# EAGLE design main (EAGLE 9.6.2)
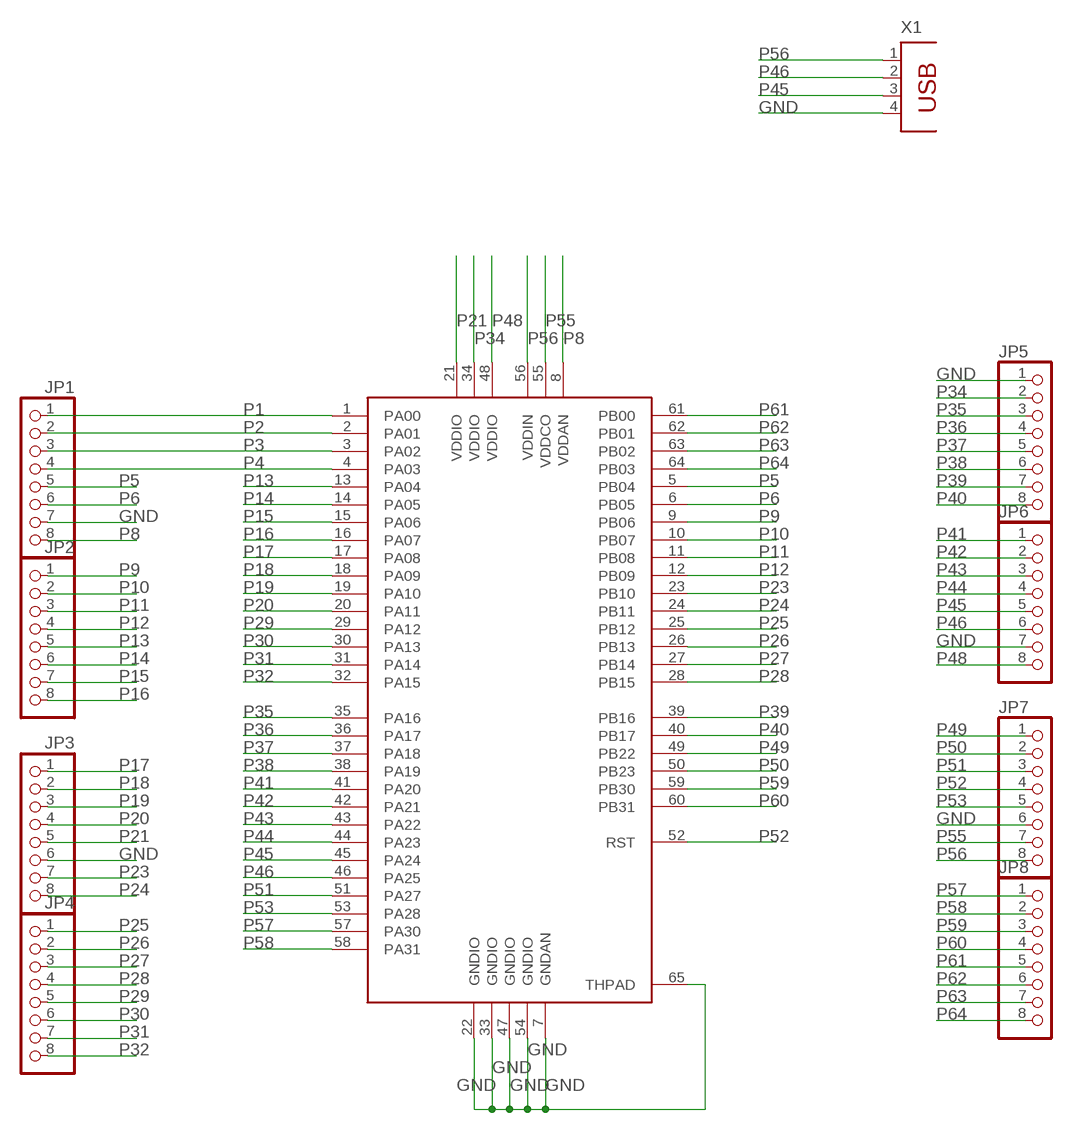
[diagram p0: schematic, sheet 1]

## Parts
JP1  PINHD-1X8CLEANBIG  [1X08-CLEANBIG]
JP2  PINHD-1X8CLEANBIG  [1X08-CLEANBIG]
JP3  PINHD-1X8CLEANBIG  [1X08-CLEANBIG]
JP4  PINHD-1X8CLEANBIG  [1X08-CLEANBIG]
JP5  PINHD-1X8CLEANBIG  [1X08-CLEANBIG]
JP6  PINHD-1X8CLEANBIG  [1X08-CLEANBIG]
JP7  PINHD-1X8CLEANBIG  [1X08-CLEANBIG]
JP8  PINHD-1X8CLEANBIG  [1X08-CLEANBIG]
U$1  ATSAMD21J18AQFN64  [QFN50P900X900X100-65T535]
X1  PN61729  [PN61729]

## Nets
GND: JP1.7 JP3.6 JP5.1 JP6.7 JP7.6 U$1.7(GNDAN) U$1.22(GNDIO) U$1.33(GNDIO) U$1.47(GNDIO) U$1.54(GNDIO) U$1.65(THPAD) X1.4
P1: JP1.1 U$1.1(PA00)
P2: JP1.2 U$1.2(PA01)
P3: JP1.3 U$1.3(PA02)
P4: JP1.4 U$1.4(PA03)
P5: JP1.5 U$1.5(PB04)
P6: JP1.6 U$1.6(PB05)
P8: JP1.8 U$1.8(VDDAN)
P9: JP2.1 U$1.9(PB06)
P10: JP2.2 U$1.10(PB07)
P11: JP2.3 U$1.11(PB08)
P12: JP2.4 U$1.12(PB09)
P13: JP2.5 U$1.13(PA04)
P14: JP2.6 U$1.14(PA05)
P15: JP2.7 U$1.15(PA06)
P16: JP2.8 U$1.16(PA07)
P17: JP3.1 U$1.17(PA08)
P18: JP3.2 U$1.18(PA09)
P19: JP3.3 U$1.19(PA10)
P20: JP3.4 U$1.20(PA11)
P21: JP3.5 U$1.21(VDDIO)
P23: JP3.7 U$1.23(PB10)
P24: JP3.8 U$1.24(PB11)
P25: JP4.1 U$1.25(PB12)
P26: JP4.2 U$1.26(PB13)
P27: JP4.3 U$1.27(PB14)
P28: JP4.4 U$1.28(PB15)
P29: JP4.5 U$1.29(PA12)
P30: JP4.6 U$1.30(PA13)
P31: JP4.7 U$1.31(PA14)
P32: JP4.8 U$1.32(PA15)
P34: JP5.2 U$1.34(VDDIO)
P35: JP5.3 U$1.35(PA16)
P36: JP5.4 U$1.36(PA17)
P37: JP5.5 U$1.37(PA18)
P38: JP5.6 U$1.38(PA19)
P39: JP5.7 U$1.39(PB16)
P40: JP5.8 U$1.40(PB17)
P41: JP6.1 U$1.41(PA20)
P42: JP6.2 U$1.42(PA21)
P43: JP6.3 U$1.43(PA22)
P44: JP6.4 U$1.44(PA23)
P45: JP6.5 U$1.45(PA24) X1.3
P46: JP6.6 U$1.46(PA25) X1.2
P48: JP6.8 U$1.48(VDDIO)
P49: JP7.1 U$1.49(PB22)
P50: JP7.2 U$1.50(PB23)
P51: JP7.3 U$1.51(PA27)
P52: JP7.4 U$1.52(RST)
P53: JP7.5 U$1.53(PA28)
P55: JP7.7 U$1.55(VDDCO)
P56: JP7.8 U$1.56(VDDIN) X1.1
P57: JP8.1 U$1.57(PA30)
P58: JP8.2 U$1.58(PA31)
P59: JP8.3 U$1.59(PB30)
P60: JP8.4 U$1.60(PB31)
P61: JP8.5 U$1.61(PB00)
P62: JP8.6 U$1.62(PB01)
P63: JP8.7 U$1.63(PB02)
P64: JP8.8 U$1.64(PB03)

## Library data of the parts
JP1-JP8 = larger_pad_header:PINHD-1X8: PIN HEADER
U$1 = atsamd21j18a:ATSAMD21J18A
X1 = con-berg:PN61729: BERG USB connector; OC_FARNELL: unknown; OC_NEWARK: unknown

## Board
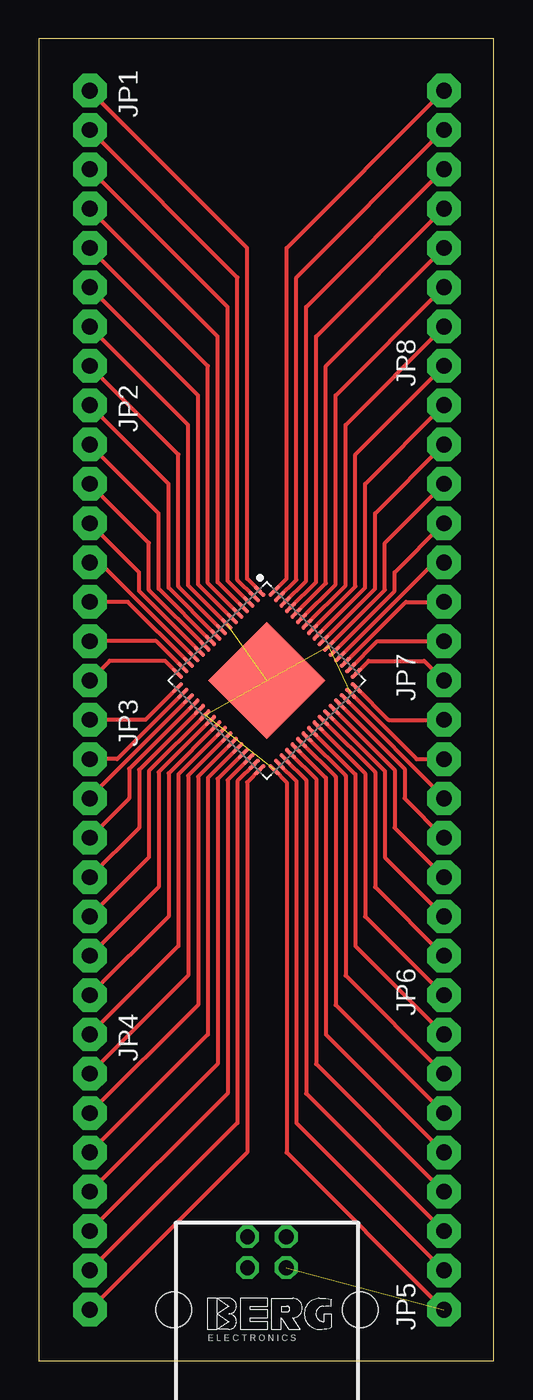
[diagram p1: board, top side]
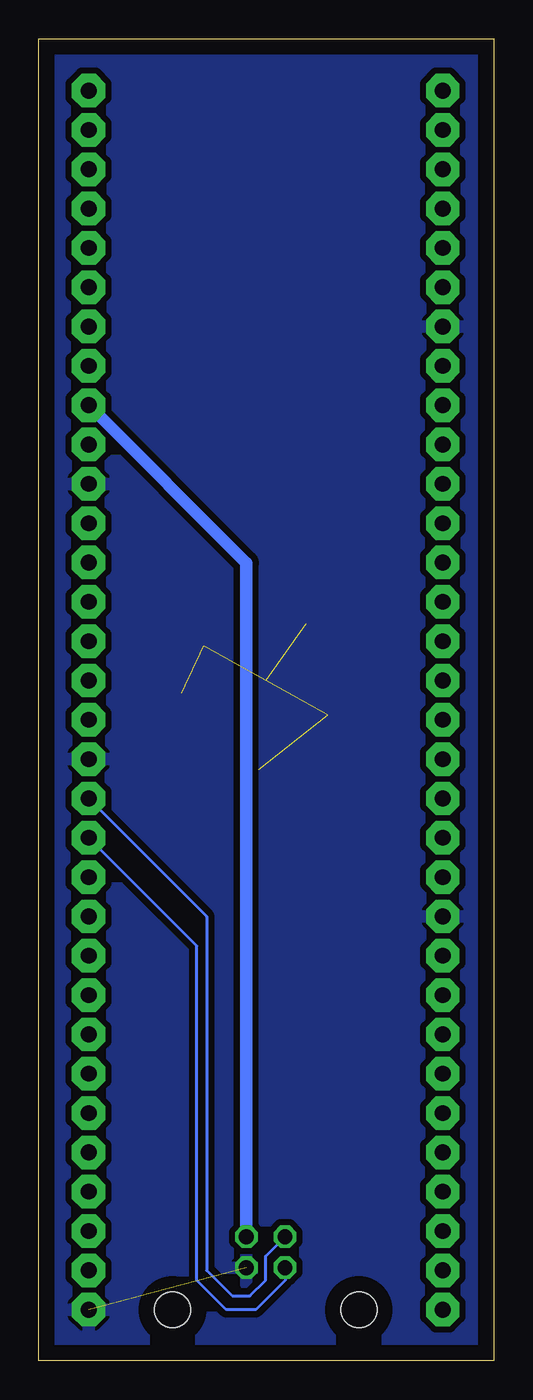
[diagram p2: board, bottom side, seen from below]

Size 29.39 x 85.39 mm. Coordinates in mm from the lower left corner, seen from the top.
Outline: 0,0 29.39,0 29.39,85.39 0,85.39 0,0
Copper layers (1*16): Top 0.035mm / dielectric 1.5mm / Bottom 0.035mm
Design rules "default *": minimum track width 6mil, minimum drill 0.35mm, track to track 8mil, track to pad 8mil, pad to pad 8mil, via to via 8mil, smd to smd 8mil, copper to edge 40mil, drill to drill 6mil, minimum pad ring 10mil, minimum via ring 8mil, stop-mask expansion 4mil, vias tented up to drill 0mil, thermal gap 10mil

### Footprints (pad centres in the part's own frame; a part is rotated, then mirrored left to right if it is on the bottom)
1X08-CLEANBIG = drill 1.016 pad 2.159 octagon: 1 -8.89,0; 2 -6.35,0; 3 -3.81,0; 4 -1.27,0; 5 1.27,0; 6 3.81,0; 7 6.35,0; 8 8.89,0
QFN50P900X900X100-65T535 = smd 0.911 x 0.264: 1 -4.401,3.75; 2 -4.401,3.25; 3 -4.401,2.75; 4 -4.401,2.25; 5 -4.401,1.75; 6 -4.401,1.25; 7 -4.401,0.75; 8 -4.401,0.25; 9 -4.401,-0.25; 10 -4.401,-0.75; 11 -4.401,-1.25; 12 -4.401,-1.75; 13 -4.401,-2.25; 14 -4.401,-2.75; 15 -4.401,-3.25; 16 -4.401,-3.75; 33 4.401,-3.75; 34 4.401,-3.25; 35 4.401,-2.75; 36 4.401,-2.25; 37 4.401,-1.75; 38 4.401,-1.25; 39 4.401,-0.75; 40 4.401,-0.25; 41 4.401,0.25; 42 4.401,0.75; 43 4.401,1.25; 44 4.401,1.75; 45 4.401,2.25; 46 4.401,2.75; 47 4.401,3.25; 48 4.401,3.75 | smd 0.264 x 0.911: 17 -3.75,-4.401; 18 -3.25,-4.401; 19 -2.75,-4.401; 20 -2.25,-4.401; 21 -1.75,-4.401; 22 -1.25,-4.401; 23 -0.75,-4.401; 24 -0.25,-4.401; 25 0.25,-4.401; 26 0.75,-4.401; 27 1.25,-4.401; 28 1.75,-4.401; 29 2.25,-4.401; 30 2.75,-4.401; 31 3.25,-4.401; 32 3.75,-4.401; 49 3.75,4.401; 50 3.25,4.401; 51 2.75,4.401; 52 2.25,4.401; 53 1.75,4.401; 54 1.25,4.401; 55 0.75,4.401; 56 0.25,4.401; 57 -0.25,4.401; 58 -0.75,4.401; 59 -1.25,4.401; 60 -1.75,4.401; 61 -2.25,4.401; 62 -2.75,4.401; 63 -3.25,4.401; 64 -3.75,4.401 | smd 5.35 x 5.35: 65 0,0
PN61729 = drill 0.95 octagon: 1 1.25,4.71; 2 -1.25,4.71; 3 -1.25,2.71; 4 1.25,2.71 | hole 2.3: -6.02,0; 6.02,0

### Placement (x,y rotation side)
JP1  3.3,73.15 270 top
JP2  3.3,52.83 270 top
JP3  3.3,32.51 270 top
JP4  3.3,12.19 270 top
JP5  26.16,12.19 90 top
JP6  26.16,32.51 90 top
JP7  26.16,52.83 90 top
JP8  26.16,73.15 90 top
U$1  14.73,43.94 315 top
X1  14.73,3.3 0 top

### Tracks (layer width: path | path; a pad name or v marks a point on that pad's centre or on a via)
GND  (6 unrouted)
  Top 0.254: U$1.47 24.41,38.86 JP6.7 | U$1.33 16,37.37 16,13.46 JP5.1 | U$1.22 7.11,38.09 7.11,32.51 JP3.6 | U$1.7 9.65,50.08 9.65,60.45 JP1.7 | U$1.54 22.35,49.79 22.35,52.83 JP7.6
  pour Bottom (isolate 0.406): 0.13,85.22 29.34,85.22 29.34,0.13 0.13,0.13
P1
  Top 0.254: U$1.1 13.46,50.52 13.46,52.2 13.46,71.88 JP1.1
P2
  Top 0.254: U$1.2 12.83,50.44 12.83,69.98 JP1.2
P3
  Top 0.254: U$1.3 12.19,50.37 12.19,68.07 JP1.3
P4
  Top 0.254: U$1.4 11.56,50.3 11.56,66.17 JP1.4
P5
  Top 0.254: U$1.5 10.92,50.23 10.92,64.26 JP1.5
P6
  Top 0.254: U$1.6 10.29,50.16 10.29,62.36 JP1.6
P8
  Top 0.254: U$1.8 9.02,50.01 9.02,58.55 JP1.8
P9
  Top 0.254: U$1.9 8.38,49.94 8.38,56.64 JP2.1
P10
  Top 0.254: U$1.10 7.75,49.87 7.75,54.74 JP2.2
P11
  Top 0.254: U$1.11 7.11,49.79 7.11,52.83 JP2.3
P12
  Top 0.254: U$1.12 6.48,49.72 6.48,50.93 JP2.4
P13
  Top 0.254: U$1.13 3.93,51.56 JP2.5
P14
  Top 0.254: U$1.14 5.76,49.02 JP2.6
P15
  Top 0.254: U$1.15 7.6,46.48 JP2.7
P16
  Top 0.254: U$1.16 8.16,45.21 4.57,45.21 JP2.8
P17
  Top 0.254: U$1.17 6.89,41.4 JP3.1
P18
  Top 0.254: U$1.18 5.06,38.86 JP3.2
P19
  Top 0.254: U$1.19 3.3,36.4 JP3.3
P20
  Top 0.254: U$1.20 5.84,38.23 5.84,36.32 JP3.4
P21
  Top 0.254: U$1.21 6.48,38.16 6.48,34.42 JP3.5
P23
  Top 0.254: U$1.23 7.75,38.02 7.75,30.61 JP3.7
P24
  Top 0.254: U$1.24 8.38,37.95 8.38,28.7 JP3.8
P25
  Top 0.254: U$1.25 9.02,37.87 9.02,26.8 JP4.1
P26
  Top 0.254: U$1.26 9.65,37.8 9.65,24.89 JP4.2
P27
  Top 0.254: U$1.27 10.29,37.73 10.29,22.99 JP4.3
P28
  Top 0.254: U$1.28 10.92,37.66 10.92,21.08 JP4.4
P29
  Top 0.254: U$1.29 11.56,37.59 11.56,19.18 JP4.5
P30
  Top 0.254: U$1.30 12.19,37.51 12.19,17.27 JP4.6
P31
  Top 0.254: U$1.31 12.83,37.44 12.83,15.37 JP4.7
P32
  Top 0.254: U$1.32 13.46,37.37 13.46,13.46 JP4.8
P34
  Top 0.254: U$1.34 16.64,37.44 16.64,15.37 JP5.2
P35
  Top 0.254: U$1.35 17.27,37.51 17.27,17.27 JP5.3
P36
  Top 0.254: U$1.36 17.91,37.59 17.91,19.18 JP5.4
P37
  Top 0.254: U$1.37 18.54,37.66 18.54,21.08 JP5.5
P38
  Top 0.254: U$1.38 19.18,37.73 19.18,22.99 JP5.6
P39
  Top 0.254: U$1.39 19.81,37.8 19.81,24.89 JP5.7
P40
  Top 0.254: U$1.40 20.45,37.87 20.45,26.8 JP5.8
P41
  Top 0.254: U$1.41 21.08,37.95 21.08,28.7 JP6.1
P42
  Top 0.254: U$1.42 21.72,38.02 21.72,30.61 JP6.2
P43
  Top 0.254: U$1.43 22.35,38.09 22.35,32.51 JP6.3
P44
  Top 0.254: U$1.44 22.99,38.16 22.99,34.42 JP6.4
P45
  Top 0.254: U$1.45 23.62,38.23 23.62,36.32 JP6.5
  Bottom 0.203: X1.3 13.48,5.19 15.37,3.3 17.27,3.3 19.18,5.21 19.18,26.8 JP6.5
P46
  Top 0.254: U$1.46 26.16,36.4 JP6.6
  Bottom 0.203: JP6.6 18.54,28.7 18.54,5.84 16.89,4.19 15.75,4.19 14.73,5.21 14.73,6.76 X1.2
P48
  Top 0.254: U$1.48 22.57,41.4 JP6.8
P49
  Top 0.254: U$1.49 21.3,45.21 24.89,45.21 JP7.1
P50
  Top 0.254: U$1.50 21.87,46.48 JP7.2
P51
  Top 0.254: U$1.51 23.7,49.02 JP7.3
P52
  Top 0.254: U$1.52 25.53,51.56 JP7.4
P53
  Top 0.254: U$1.53 22.99,49.72 22.99,50.93 JP7.5
P55
  Top 0.254: U$1.55 21.72,49.87 21.72,54.74 JP7.7
P56
  Top 0.254: U$1.56 21.08,49.94 21.08,56.64 JP7.8
  Bottom 0.813: X1.1 15.98,51.54 JP7.8
P57
  Top 0.254: U$1.57 20.45,50.01 20.45,58.55 JP8.1
P58
  Top 0.254: U$1.58 19.81,50.08 19.81,60.45 JP8.2
P59
  Top 0.254: U$1.59 19.18,50.16 19.18,62.36 JP8.3
P60
  Top 0.254: U$1.60 18.54,50.23 18.54,64.26 JP8.4
P61
  Top 0.254: U$1.61 17.91,50.3 17.91,66.17 JP8.5
P62
  Top 0.254: U$1.62 17.27,50.37 17.27,68.07 JP8.6
P63
  Top 0.254: U$1.63 16.64,50.44 16.64,69.98 JP8.7
P64
  Top 0.254: U$1.64 16,50.52 16,71.88 JP8.8